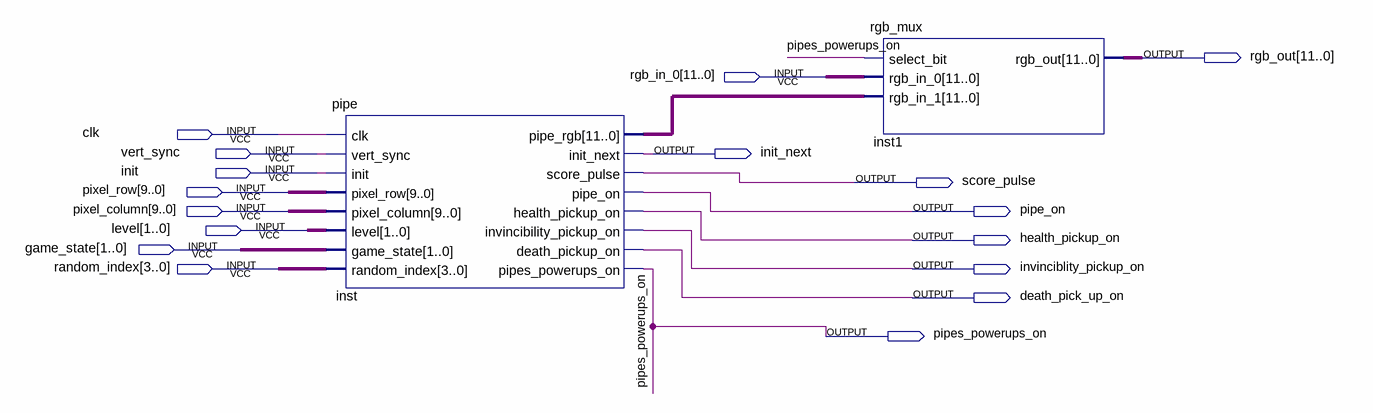
[diagram p0: schematic sheet]
// Quartus schematic pipe_and_mux.bdf as structural Verilog: 2 symbols, 17 pins
module pipe_and_mux (
  input  [11:0] rgb_in_0,
  input  clk,
  input  vert_sync,
  input  init,
  input  [9:0] pixel_row,
  input  [9:0] pixel_column,
  input  [1:0] level,
  input  [1:0] game_state,
  input  [3:0] random_index,
  output [11:0] rgb_out,
  output init_next,
  output score_pulse,
  output pipe_on,
  output health_pickup_on,
  output invinciblity_pickup_on,
  output death_pick_up_on,
  output pipes_powerups_on
);

  wire [11:0] inst_pipe_rgb;

  pipe inst (
    .clk(clk), .vert_sync(vert_sync), .init(init), .pixel_row(pixel_row), .pixel_column(pixel_column),
    .level(level), .game_state(game_state), .random_index(random_index), .pipe_rgb(inst_pipe_rgb),
    .init_next(init_next), .score_pulse(score_pulse), .pipe_on(pipe_on), .health_pickup_on(health_pickup_on),
    .invincibility_pickup_on(invinciblity_pickup_on), .death_pickup_on(death_pick_up_on),
    .pipes_powerups_on(pipes_powerups_on));
  rgb_mux inst1 (.select_bit(pipes_powerups_on), .rgb_in_0(rgb_in_0), .rgb_in_1(inst_pipe_rgb), .rgb_out(rgb_out));
endmodule
